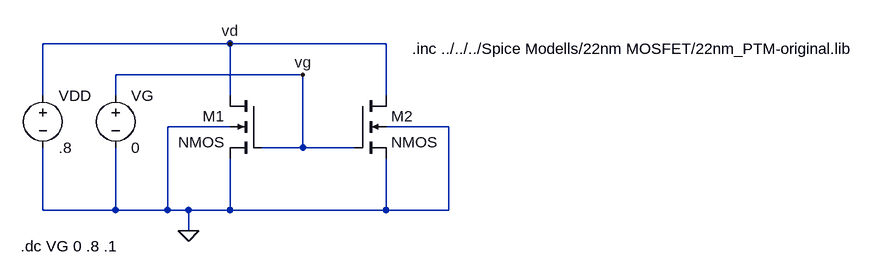
[diagram p0: schematic differenzverstaerker.asc]
differenzverstaerker.asc, the LTspice schematic file:
Version 4
SHEET 1 1056 680
WIRE -32 -80 -320 -80
WIRE 208 -80 -32 -80
WIRE 80 -32 -208 -32
WIRE -320 0 -320 -80
WIRE -208 0 -208 -32
WIRE -32 0 -32 -80
WIRE 208 0 208 -80
WIRE -32 48 -128 48
WIRE 304 48 208 48
WIRE 80 80 80 -32
WIRE 80 80 16 80
WIRE 160 80 80 80
WIRE -320 176 -320 80
WIRE -208 176 -208 80
WIRE -208 176 -320 176
WIRE -128 176 -128 48
WIRE -128 176 -208 176
WIRE -96 176 -128 176
WIRE -32 176 -32 96
WIRE -32 176 -96 176
WIRE 208 176 208 96
WIRE 208 176 -32 176
WIRE 304 176 304 48
WIRE 304 176 208 176
WIRE -96 208 -96 176
FLAG -96 208 0
FLAG -32 -80 vd
FLAG 80 -32 vg
SYMBOL nmos4 16 0 M0
SYMATTR InstName M1
SYMATTR Value2 l=28n w=56n
SYMBOL nmos4 160 0 R0
SYMATTR InstName M2
SYMBOL voltage -320 -16 R0
SYMATTR InstName VDD
SYMATTR Value .8
SYMBOL voltage -208 -16 R0
SYMATTR InstName VG
SYMATTR Value 0
TEXT -354 232 Left 2 !.dc VG 0 .8 .1
TEXT 248 -72 Left 2 !.inc ../../../Spice Modells/22nm MOSFET/22nm_PTM-original.lib

The netlist it stands for:
* differenzverstaerker.asc
M1 vd vg 0 0 NMOS l=28n w=56n
M2 vd vg 0 0 NMOS
VDD vd 0 .8
VG vg 0 0
.model NMOS NMOS
.model PMOS PMOS
.lib standard.mos
.dc VG 0 .8 .1
.inc ../../../Spice Modells/22nm MOSFET/22nm_PTM-original.lib
.backanno
.end